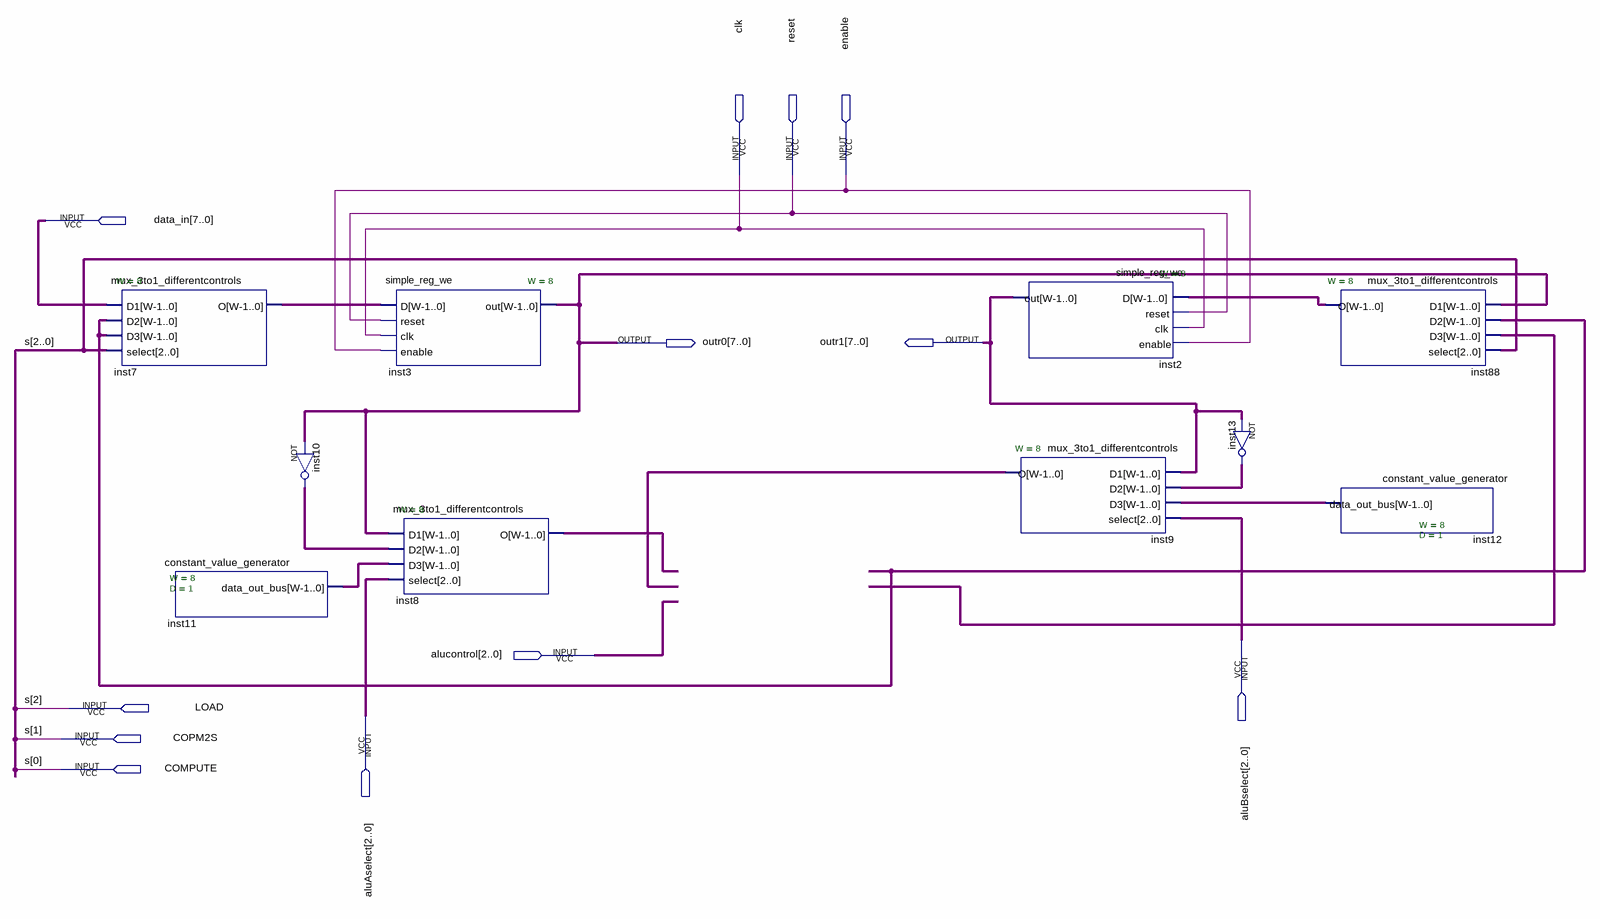
[diagram p0: schematic sheet]
// Quartus schematic lab2.bdf as structural Verilog: 10 symbols, 12 pins
module lab2 (
  input  clk,
  input  reset,
  input  enable,
  input  [7:0] data_in,
  input  [2:0] aluBselect,
  input  [2:0] alucontrol,
  input  LOAD,
  input  [2:0] aluAselect,
  input  COPM2S,
  input  COMPUTE,
  output [7:0] outr0,
  output [7:0] outr1
);

  wire [7:0] inst7_o, inst8_o, inst9_o, inst10_out, inst11_data_out_bus, inst12_data_out_bus, inst13_out,
       inst88_o, undriven, undriven_2;

  mux_3to1_differentcontrols #(.W(8)) inst7 (
    .D1(data_in), .D2(undriven_2), .D3(undriven_2), .select({LOAD, COPM2S, COMPUTE}), .O(inst7_o));
  constant_value_generator #(.W(8), .D(1)) inst11 (.data_out_bus(inst11_data_out_bus));
  assign inst10_out = ~outr0;  // NOT inst10, 8 bits wide
  simple_reg_we #(.W(8)) inst3 (.D(inst7_o), .reset(reset), .clk(clk), .enable(enable), .out(outr0));
  mux_3to1_differentcontrols #(.W(8)) inst8 (
    .D1(outr0), .D2(inst10_out), .D3(inst11_data_out_bus), .select(aluAselect), .O(inst8_o));
  simple_reg_we #(.W(8)) inst2 (.D(inst88_o), .reset(reset), .clk(clk), .enable(enable), .out(outr1));
  mux_3to1_differentcontrols #(.W(8)) inst9 (
    .D1(outr1), .D2(inst13_out), .D3(inst12_data_out_bus), .select(aluBselect), .O(inst9_o));
  assign inst13_out = ~outr1;  // NOT inst13, 8 bits wide
  mux_3to1_differentcontrols #(.W(8)) inst88 (
    .D1(outr0), .D2(undriven_2), .D3(undriven), .select({LOAD, COPM2S, COMPUTE}), .O(inst88_o));
  constant_value_generator #(.W(8), .D(1)) inst12 (.data_out_bus(inst12_data_out_bus));

  // Other names for the same wires on the sheet: s[2:0] = {LOAD, COPM2S, COMPUTE}
endmodule
